# Altium schematic sheet GR_Action_Ascensseur.SchDoc
size A4
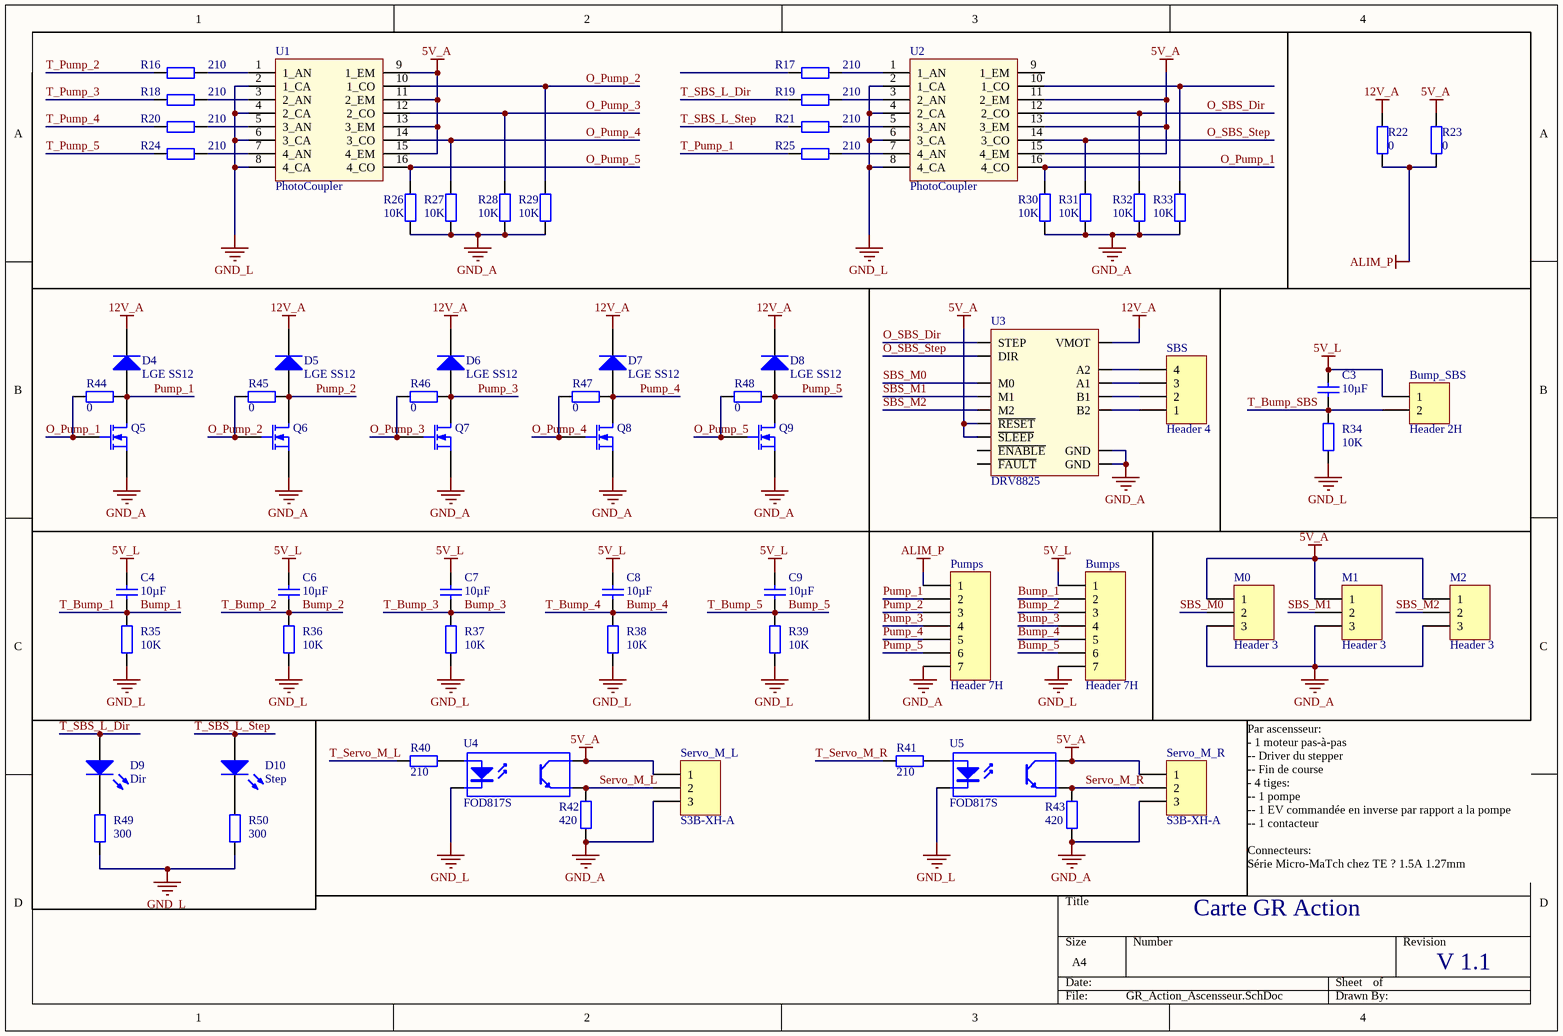
[diagram p0: GR_Action_Ascensseur.SchDoc]

## Parts
Bump_SBS  Header 2H  [S2B-XH-A]
Bumps  Header 7H  [S7B-XH-A]
C3  value 10µF  [Capacitor 1206]
C4  value 10µF  [Capacitor 1206]
C6  value 10µF  [Capacitor 1206]
C7  value 10µF  [Capacitor 1206]
C8  value 10µF  [Capacitor 1206]
C9  value 10µF  [Capacitor 1206]
D4  LGE SS12  [SMB]
D5  LGE SS12  [SMB]
D6  LGE SS12  [SMB]
D7  LGE SS12  [SMB]
D8  LGE SS12  [SMB]
D9  Dir  [KP-3216SEC]
D10  Step  [KP-3216SEC]
M0  Header 3  [HDR1X3]
M1  Header 3  [HDR1X3]
M2  Header 3  [HDR1X3]
Pumps  Header 7H  [S7B-XH-A]
Q5  MOSFET-N  [SOT23_M]  (value not drawn)
Q6  MOSFET-N  [SOT23_M]  (value not drawn)
Q7  MOSFET-N  [SOT23_M]  (value not drawn)
Q8  MOSFET-N  [SOT23_M]  (value not drawn)
Q9  MOSFET-N  [SOT23_M]  (value not drawn)
R16  value 210  [Resistor 1206]  (hidden comment: Res2)
R17  value 210  [Resistor 1206]  (hidden comment: Res2)
R18  value 210  [Resistor 1206]  (hidden comment: Res2)
R19  value 210  [Resistor 1206]  (hidden comment: Res2)
R20  value 210  [Resistor 1206]  (hidden comment: Res2)
R21  value 210  [Resistor 1206]  (hidden comment: Res2)
R22  value 0  [Resistor 1206]  (hidden comment: Res2)
R23  value 0  [Resistor 1206]  (hidden comment: Res2)
R24  value 210  [Resistor 1206]  (hidden comment: Res2)
R25  value 210  [Resistor 1206]  (hidden comment: Res2)
R26  value 10K  [Resistor 1206]  (hidden comment: Res2)
R27  value 10K  [Resistor 1206]  (hidden comment: Res2)
R28  value 10K  [Resistor 1206]  (hidden comment: Res2)
R29  value 10K  [Resistor 1206]  (hidden comment: Res2)
R30  value 10K  [Resistor 1206]  (hidden comment: Res2)
R31  value 10K  [Resistor 1206]  (hidden comment: Res2)
R32  value 10K  [Resistor 1206]  (hidden comment: Res2)
R33  value 10K  [Resistor 1206]  (hidden comment: Res2)
R34  value 10K  [Resistor 1206]  (hidden comment: Res2)
R35  value 10K  [Resistor 1206]  (hidden comment: Res2)
R36  value 10K  [Resistor 1206]  (hidden comment: Res2)
R37  value 10K  [Resistor 1206]  (hidden comment: Res2)
R38  value 10K  [Resistor 1206]  (hidden comment: Res2)
R39  value 10K  [Resistor 1206]  (hidden comment: Res2)
R40  value 210  [Resistor 1206]  (hidden comment: Res2)
R41  value 210  [Resistor 1206]  (hidden comment: Res2)
R42  value 420  [Resistor 1206]  (hidden comment: Res2)
R43  value 420  [Resistor 1206]  (hidden comment: Res2)
R44  value 0  [Resistor 1206]  (hidden comment: Res2)
R45  value 0  [Resistor 1206]  (hidden comment: Res2)
R46  value 0  [Resistor 1206]  (hidden comment: Res2)
R47  value 0  [Resistor 1206]  (hidden comment: Res2)
R48  value 0  [Resistor 1206]  (hidden comment: Res2)
R49  value 300  [Resistor 1206]  (hidden comment: Res2)
R50  value 300  [Resistor 1206]  (hidden comment: Res2)
SBS  Header 4  [S4B-XH-A]
Servo_M_L  S3B-XH-A  [S3B-XH-A]
Servo_M_R  S3B-XH-A  [S3B-XH-A]
U1  PhotoCoupler  [LTV-247]
U2  PhotoCoupler  [LTV-247]
U3  DRV8825  [DRV8825]
U4  FOD817S  [SOP254P1016X385-4N]
U5  FOD817S  [SOP254P1016X385-4N]

## Nets
5V_A: M0.1 M1.1 M2.1 R23.1 Servo_M_L.1 Servo_M_R.1 U1.9(1_EM) U1.11(2_EM) U1.13(3_EM) U1.15(4_EM) U2.11(2_EM) U2.13(3_EM) U2.15(4_EM) U3.5(~{RESET}) U3.6(~{SLEEP}) U4.4(C) U5.4(C)
5V_L: Bump_SBS.1 Bumps.1 C3.2 C4.2 C6.2 C7.2 C8.2 C9.2
12V_A: D4.2(K) D5.2(K) D6.2(K) D7.2(K) D8.2(K) R22.1 U3.16(VMOT)
ALIM_P: Pumps.1 R22.2 R23.2
GND_A: M0.3 M1.3 M2.3 Pumps.7 Q5.3(S) Q6.3(S) Q7.3(S) Q8.3(S) Q9.3(S) R26.1 R27.1 R28.1 R29.1 R30.1 R31.1 R32.1 R33.1 R42.1 R43.1 Servo_M_L.3 Servo_M_R.3 U3.9(GND) U3.15(GND)
GND_L: Bumps.7 R34.1 R35.1 R36.1 R37.1 R38.1 R39.1 R49.1 R50.1 U1.2(1_CA) U1.4(2_CA) U1.6(3_CA) U1.8(4_CA) U2.2(1_CA) U2.4(2_CA) U2.6(3_CA) U2.8(4_CA) U4.2(K) U5.2(K)
Bump_1: Bumps.2 C4.1 R35.2  [also labelled T_Bump_1]
Bump_2: Bumps.3 C6.1 R36.2  [also labelled T_Bump_2]
Bump_3: Bumps.4 C7.1 R37.2  [also labelled T_Bump_3]
Bump_4: Bumps.5 C8.1 R38.2  [also labelled T_Bump_4]
Bump_5: Bumps.6 C9.1 R39.2  [also labelled T_Bump_5]
O_Pump_1: Q5.2(G) R30.2 R44.1 U2.16(4_CO)
O_Pump_2: Q6.2(G) R29.2 R45.1 U1.10(1_CO)
O_Pump_3: Q7.2(G) R28.2 R46.1 U1.12(2_CO)
O_Pump_4: Q8.2(G) R27.2 R47.1 U1.14(3_CO)
O_Pump_5: Q9.2(G) R26.2 R48.1 U1.16(4_CO)
O_SBS_Dir: R32.2 U2.12(2_CO) U3.7(STEP)
O_SBS_Step: R31.2 U2.14(3_CO) U3.8(DIR)
Pump_1: D4.1(A) Pumps.2 Q5.1(D) R44.2
Pump_2: D5.1(A) Pumps.3 Q6.1(D) R45.2
Pump_3: D6.1(A) Pumps.4 Q7.1(D) R46.2
Pump_4: D7.1(A) Pumps.5 Q8.1(D) R47.2
Pump_5: D8.1(A) Pumps.6 Q9.1(D) R48.2
SBS_M0: M0.2 U3.2(M0)
SBS_M1: M1.2 U3.3(M1)
SBS_M2: M2.2 U3.4(M2)
Servo_M_L: R42.2 Servo_M_L.2 U4.3(E)
Servo_M_R: R43.2 Servo_M_R.2 U5.3(E)
T_Bump_SBS: Bump_SBS.2 C3.1 R34.2
T_Pump_1: R25.2
T_Pump_2: R16.2
T_Pump_3: R18.2
T_Pump_4: R20.2
T_Pump_5: R24.2
T_SBS_L_Dir: D9.1(A) R19.2
T_SBS_L_Step: D10.1(A) R21.2
T_Servo_M_L: R40.2
T_Servo_M_R: R41.2
NetD9_2: D9.2(K) R49.2
NetD10_2: D10.2(K) R50.2
NetR16_1: R16.1 U1.1(1_AN)
NetR17_1: R17.1 U2.1(1_AN)
NetR18_1: R18.1 U1.3(2_AN)
NetR19_1: R19.1 U2.3(2_AN)
NetR20_1: R20.1 U1.5(3_AN)
NetR21_1: R21.1 U2.5(3_AN)
NetR24_1: R24.1 U1.7(4_AN)
NetR25_1: R25.1 U2.7(4_AN)
NetR33_2: R33.2 U2.10(1_CO)
NetR40_1: R40.1 U4.1(A)
NetR41_1: R41.1 U5.1(A)
NetSBS_1: SBS.1 U3.14(B2)
NetSBS_2: SBS.2 U3.13(B1)
NetSBS_3: SBS.3 U3.12(A1)
NetSBS_4: SBS.4 U3.11(A2)

Not connected (* = marked no-connect by the designer): R17 2; U2 9(1_EM); U3 1(~{ENABLE}) 10(~{FAULT})

## Notes on the sheet
- Carte GR Action
- Par ascensseur:
  - 1 moteur pas-à-pas
  -- Driver du stepper
  -- Fin de course
  - 4 tiges:
  -- 1 pompe
  -- 1 EV commandée en inverse par rapport a la pompe
  -- 1 contacteur
  Connecteurs:
  Série Micro-MaTch chez TE ? 1.5A 1.27mm
- V 1.1

## Library data of the parts
Bump_SBS = Header 2H: Header, 2-Pin, Right Angle; LatestRevisionDate: 17-Jul-2002; LatestRevisionNote: Re-released for DXP Platform.; Publisher: Altium Limited
Bumps Pumps = Header 7H: Header, 7-Pin, Right Angle; LatestRevisionDate: 17-Jul-2002; LatestRevisionNote: Re-released for DXP Platform.; Publisher: Altium Limited
C3 C4 C6-C9 = Cap: Capacitor; Published: 8-Jun-2000; LatestRevisionDate: 17-Jul-2002; LatestRevisionNote: Re-released for DXP Platform.; PackageReference: RAD-0.3; Publisher: Altium Limited; PackageDescription: Radial Cap, Thru-Hole; 2 Leads; 0.3 in Pin Spacing
D4-D8 = Diode: Default Diode; Published: 8-Jun-2000; LatestRevisionDate: 17-Jul-2002; LatestRevisionNote: Re-released for DXP Platform.; PackageVersion: Sep-1996; PackageReference: SMC; Publisher: Altium Limited; PackageDescription: DO-214-AB/SMC; 2 C-Bend Leads; Body 7.9 x 5.9 mm, inc. leads (LxW); Code_JEDEC: DO-214-AB
D9 D10 = LED2: Typical RED, GREEN, YELLOW, AMBER GaAs LED; Published: 8-Jun-2000; LatestRevisionDate: 17-Jul-2002; LatestRevisionNote: Re-released for DXP Platform.; PackageVersion: Feb-2002; PackageReference: 3.2X1.6X1.1; Publisher: Altium Limited; PackageDescription: SM LED; 2 Flat Leads
M0-M2 = Header 3: Header, 3-Pin; LatestRevisionDate: 17-Jul-2002; LatestRevisionNote: Re-released for DXP Platform.; Publisher: Altium Limited
Q5-Q9 = MOSFET-N: N-Channel MOSFET; pin to pad: 2>3 3>2; Published: 8-Jun-2000; LatestRevisionDate: 17-Jul-2002; LatestRevisionNote: Re-released for DXP Platform.; PackageVersion: 1995/1996; PackageReference: E3; Publisher: Altium Limited; PackageDescription: TO, Flat Index; 3 In-Line, Axial Leads; Body Dia. 4.6mm; Lead Dia. 0.5 mm (max)
R16-R50 = Res2: Resistor; Published: 8-Jun-2000; LatestRevisionDate: 17-Jul-2002; LatestRevisionNote: Re-released for DXP Platform.; PackageReference: AXIAL-0.4; Publisher: Altium Limited; PackageDescription: Axial Device, Thru-Hole; 2 Leads; 0.4 in Pin Spacing
SBS = Header 4: Header, 4-Pin; LatestRevisionDate: 17-Jul-2002; LatestRevisionNote: Re-released for DXP Platform.; Publisher: Altium Limited
Servo_M_L Servo_M_R = Header 3H: Header, 3-Pin, Right Angle; LatestRevisionDate: 17-Jul-2002; LatestRevisionNote: Re-released for DXP Platform.; Publisher: Altium Limited
U1 U2 = LTV-247: Integrated Circuit; Manufacturer_Name: Lite-On; Datasheet Link: http://optoelectronics.liteon.com/upload/download/DS70-2009-0014/LTV-2X7%20sereis%20Mar17.PDF; Manufacturer_Part_Number: LTV-247; Mouser Part Number: 859-LTV-247; Mouser Price/Stock: https://www.mouser.co.uk/ProductDetail/Lite-On/LTV-247/?qs=9ayhpukWNmvWpoxQBzWkFA%3D%3D; Arrow Part Number: LTV-247; Arrow Price/Stock: https://www.arrow.com/en/products/ltv-247/lite-on-technology
U3 = DRV8825: Stepper Driver Module
U4 U5 = Optoisolator1: 4-Pin Phototransistor Optocoupler; Published: 24-Mar-1999; LatestRevisionDate: 04-Mar-2005; LatestRevisionNote: Sch pins 3 & 4 Swapped.; DatasheetVersion: Nov-2003; PackageReference: DIP-4; Publisher: Altium Limited